# EAGLE design rgb-wifi (EAGLE 7.6.0)
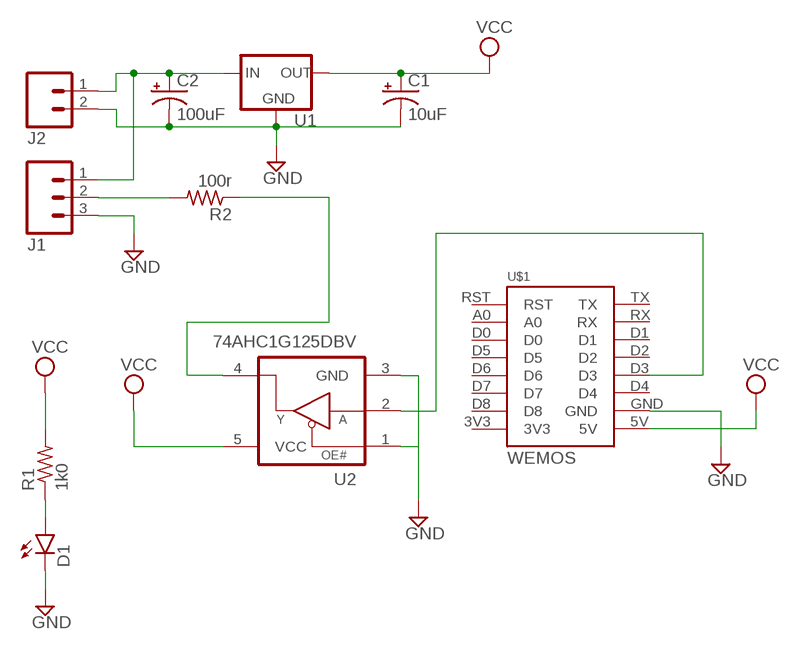
[diagram p0: schematic, sheet 1]

## Parts
C1  10uF  10UF-25V-20%(PTH)  [CPOL-RADIAL-10UF-25V]
C2  100uF  100UF-25V-20%(PTH)  [CPOL-RADIAL-100UF-25V]
D1  LED3MM  [LED3MM]
J1  M03SCREW  [SCREWTERMINAL-3.5MM-3]
J2  M023.5MM  [SCREWTERMINAL-3.5MM-2]
R1  1k0  R-US_0204/2V  [0204V]
R2  100r  R-US_0204/2V  [0204V]
U1  +12v  V_REG_78XX7812  [TO-252]
U2  74AHC1G125DBV  [SOT23-5]
U$1  WEMOS  [WEMOS]

## Nets
GND: C1.2(-) C2.2(-) D1.K(C) J1.3 J2.2 U1.3(GND) U2.1(OE#) U2.3(GND) U$1.GND
N$1: C2.1(+) J1.1 J2.1 U1.1(IN)
N$2: D1.A R1.1
N$3: J1.2 R2.2
N$4: R2.1 U2.4(Y)
N$5: U2.2(A) U$1.D3
VCC: C1.1(+) R1.2 U1.2(OUT) U2.5(VCC) U$1.5V
Unconnected: U$1.3V3 U$1.A0 U$1.D0 U$1.D1 U$1.D2 U$1.D4 U$1.D5 U$1.D6 U$1.D7 U$1.D8 U$1.RST U$1.RX U$1.TX

## Library data of the parts
C1 = SparkFun-Capacitors:10UF-25V-20%(PTH): CAP-08440; PROD_ID: CAP-08440
C2 = SparkFun-Capacitors:100UF-25V-20%(PTH): CAP-08439; PROD_ID: CAP-08439
D1 = SparkFun-LED:LED: LEDs Standard schematic elements and footprints for 5mm, 3mm, 1206, and 0603 sized LEDs. 5mm - Spark Fun Electronics SKU : COM-00529 (and others); PROD_ID: DIO-08794
J1 = SparkFun-Connectors:M03: Header 3 Standard 3-pin 0.1" header. Use with straight break away headers (SKU : PRT-00116), right angle break away headers (PRT-00553), swiss pins (PRT-00743), machine pins (PRT-00117), and female headers (PRT-00115). Molex polarized connector foot print use with SKU : PRT-08232 with associated crimp pins and housings.; PROD_ID: CONN-08288
J2 = SparkFun-Connectors:M02: Standard 2-pin 0.1" header. Use with - straight break away headers ( PRT-00116) - right angle break away headers (PRT-00553) - swiss pins (PRT-00743) - machine pins (PRT-00117) - female headers (PRT-00115) Molex polarized connector foot print use with: PRT-08233 with associated crimp pins and housings. 2.54_SCREWTERM for use with PRT-10571. 3.5mm Screw Terminal footprints for PRT-08084 5mm Screw Terminal footprints for use with PRT-08432; PROD_ID: CONN-08399
R1 R2 = resistor:R-US_: RESISTOR, American symbol
U1 = SparkFun-PowerIC:V_REG_78XX: Voltage Regulator Standard 78xx regulator. IGO (Input Ground Output). Spark Fun Electronics SKU : COM-00107; PROD_ID: VREG-12370
U2 = 74ah:74AHC1G125: TRI-STATE SINGLE BUSS BUFFER
U$1 = 1455413453956-wemos:WEMOS

## Board
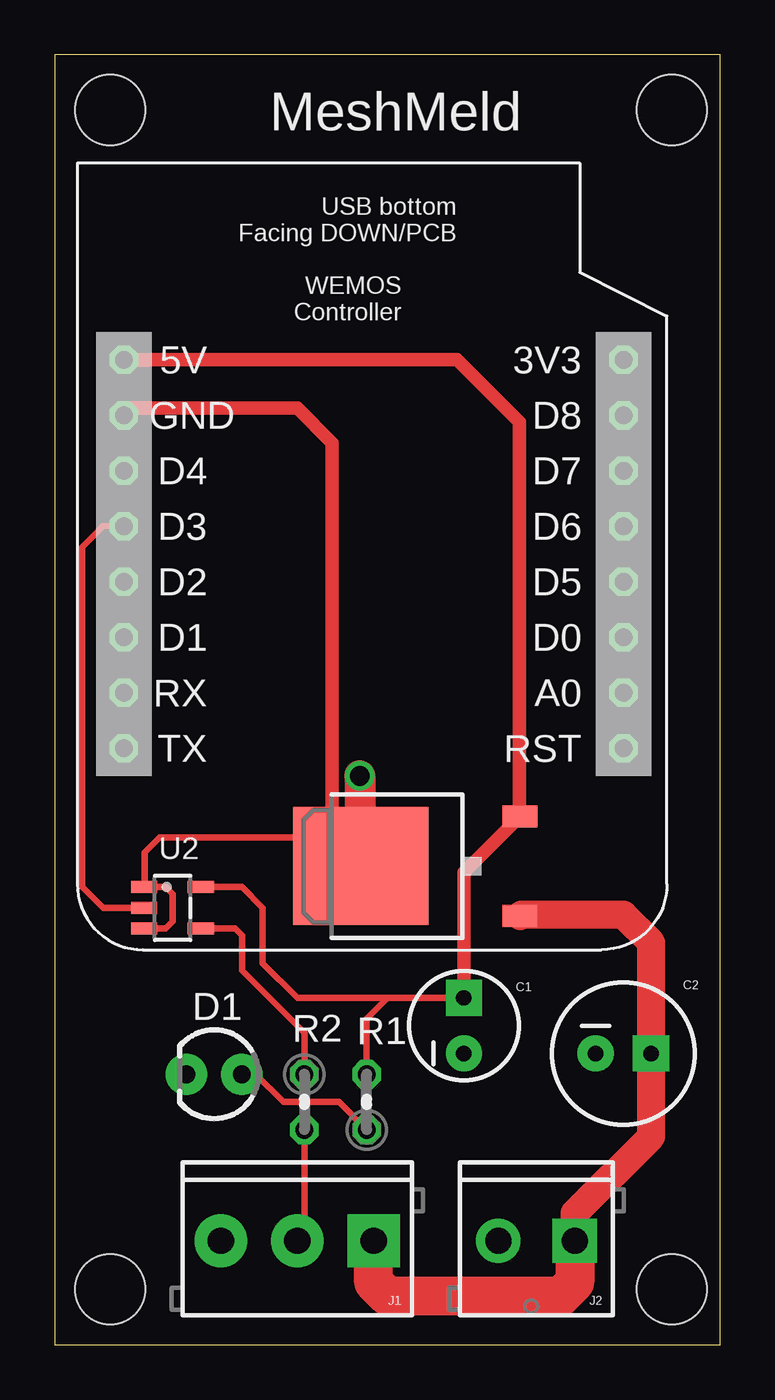
[diagram p1: board, top side]
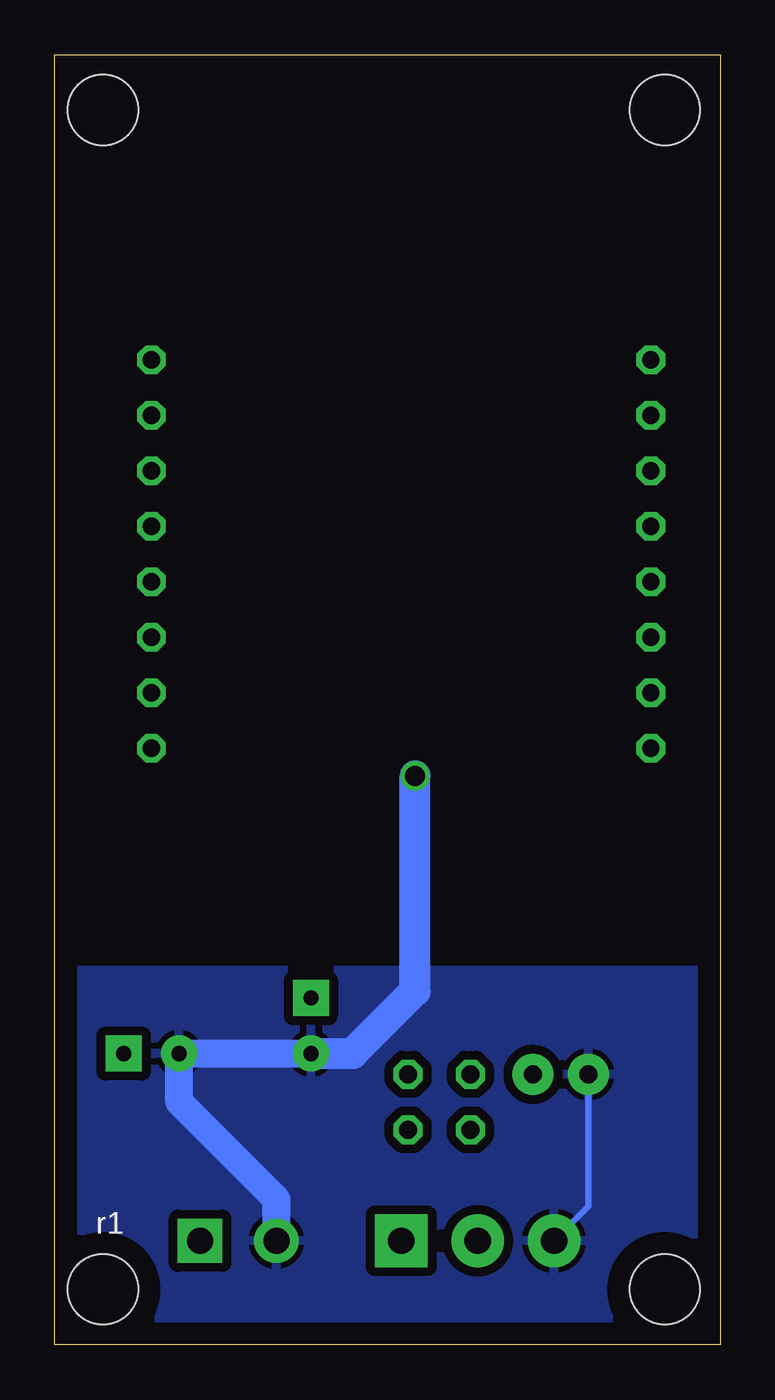
[diagram p2: board, bottom side, seen from below]

Size 30.47 x 59.05 mm. Coordinates in mm from the lower left corner, seen from the top.
Outline: 0,0 30.47,0 30.47,59.05 0,59.05 0,0
Copper layers (1*16): Top 0.035mm / dielectric 1.5mm / Bottom 0.035mm
Design rules "default": minimum track width 10mil, minimum drill 24mil, track to track 8mil, track to pad 8mil, pad to pad 8mil, via to via 8mil, smd to smd 8mil, copper to edge 40mil, drill to drill 8mil, minimum pad ring 10mil, minimum via ring 8mil, stop-mask expansion 4mil, vias tented up to drill 0mil, thermal gap 10mil
Holes 3.2 mm at 2.54,2.54 28.26,2.54 2.54,56.52 28.26,56.52

### Footprints (pad centres in the part's own frame; a part is rotated, then mirrored left to right if it is on the bottom)
CPOL-RADIAL-10UF-25V = drill 0.7 pad 1.651 square: 1 1.27,0 | drill 0.7 pad 1.651: 2 -1.27,0
CPOL-RADIAL-100UF-25V = drill 0.7 pad 1.651 square: 1 1.27,0 | drill 0.7 pad 1.651: 2 -1.27,0
LED3MM = drill 0.813 pad 1.88: A -1.27,0; K 1.27,0
SCREWTERMINAL-3.5MM-3 = drill 1.2 pad 2.413 square: 1 0,0 | drill 1.2 pad 2.413: 2 3.5,0; 3 7,0
SCREWTERMINAL-3.5MM-2 = drill 1.2 pad 2.032 square: 1 0,0 | drill 1.2 pad 2.032: 2 3.5,0
0204V = drill 0.813 octagon: 1 -1.27,0; 2 1.27,0
TO-252 = smd 1 x 1.6: 1 -2.28,-4.8; 2 2.28,-4.8 | smd 5.4 x 6.2: 3 0,2.5
SOT23-5 = smd 0.55 x 1.2: 1 -0.95,-1.3; 2 0,-1.3; 3 0.95,-1.3; 4 0.95,1.3; 5 -0.95,1.3
WEMOS = drill 0.8 octagon: 3V3 0,0; 5V 22.86,0; A0 0,15.24; D0 0,12.7; D1 22.86,12.7; D2 22.86,10.16; D3 22.86,7.62; D4 22.86,5.08; D5 0,10.16; D6 0,7.62; D7 0,5.08; D8 0,2.54; GND 22.86,2.54; RST 0,17.78; RX 22.86,15.24; TX 22.86,17.78

### Placement (x,y rotation side)
C1  18.73,14.61 90 top
C2  26.04,13.34 0 top
D1  7.3,12.38 180 top
J1  14.61,4.76 180 top
J2  23.81,4.76 180 top
R1  14.29,11.11 90 top
R2  11.43,11.11 270 top
U1  16.51,21.91 90 top
U2  5.4,20 270 top
U$1  26.04,45.09 180 top

### Tracks (layer width: path | path; a pad name or v marks a point on that pad's centre or on a via)
GND  (via drill 0.9 pad 1.27)
  Top 0.305: U2.3 5.08,19.05 5.4,19.37 5.4,20.64 5.08,20.95 U2.1 4.13,20.98 4.13,22.54 4.8,23.22 12.7,23.22
  Top 0.61: U1.3 12.7,23.22 12.7,41.27 11.11,42.86 3.17,42.86 U$1.GND
  Top 1.422: v13.97,26.04 13.97,21.95 U1.3
  Bottom 0.305: D1.K 6.03,6.33 J1.3
  Bottom 1.27: J2.2 20.31,6.66 24.77,11.11 C2.2 C1.2
  Bottom 1.422: C1.2 16.83,13.34 13.97,16.19 v13.97,26.04
  pour Bottom (isolate 0.406): 30.48,0 0,0 0,17.14 30.48,17.14
N$1
  Top 1.27: J2.1 23.81,6.03 27.3,9.53 C2.1 27.3,18.41 26.04,19.68 21.37,19.68 U1.1
  Top 1.778: J2.1 23.81,2.86 23.18,2.22 15.24,2.22 14.61,2.86 J1.1
N$2
  Top 0.305: D1.A 9.21,12.38 10.48,11.11 13.02,11.11 R1.1
N$3
  Top 0.305: R2.2 11.43,5.09 J1.2
N$4
  Top 0.305: U2.4 8.25,19.05 8.57,18.73 8.57,17.14 11.43,14.29 R2.1
N$5
  Top 0.305: U2.2 2.22,20 1.27,20.95 1.27,36.51 2.22,37.47 U$1.D3
VCC
  Top 0.305: U2.5 8.57,20.95 9.53,20 9.53,17.46 11.11,15.88 15.24,15.88 | 15.24,15.88 C1.1 | R1.2 14.29,14.92 15.24,15.88
  Top 0.61: C1.1 18.73,21.61 U1.2 21.27,24.23 21.27,42.23 18.41,45.09 U$1.5V

### Text on the board
_tsilk: MeshMeld
_bsilk: r1